# Altium schematic sheet ECG.SchDoc
size A; SheetNumber: 3; SheetTotal: 3
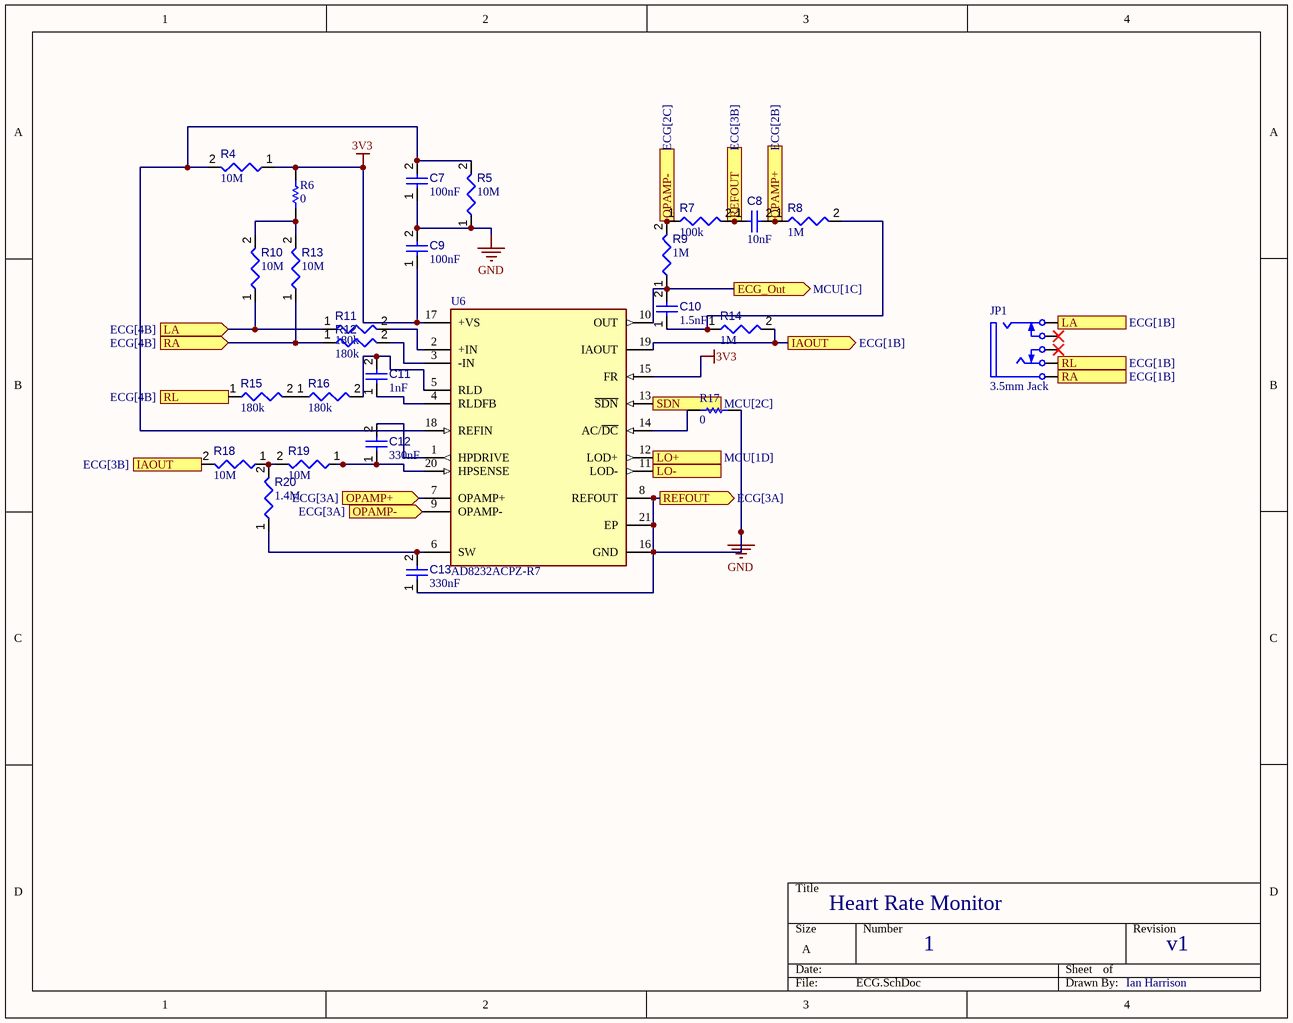
[diagram p0: ECG.SchDoc]

## Parts
C7  value 100nF  [CAPC1608X90X40NL10T20]  (hidden comment: Capacitor 100 nF +/-10% 50 V 0603)
C8  value 10nF  [FP-CC0603-DA-IPC_B]  (hidden comment: Capacitor 10nF 0603)
C9  value 100nF  [CAPC1608X90X40NL10T20]  (hidden comment: Capacitor 100 nF +/-10% 50 V 0603)
C10  value 1.5nF  [FP-GRM188-0_1-e0_2_0_5-IPC_B]  (hidden comment: Capacitor 1.5 nF 0603)
C11  value 1nF  [FP-0603-L_1_6_0_15-W_0_81-IPC_C]  (hidden comment: Capacitor 1 nF 0603)
C12  value 330nF  [FP-C1608-080-0_1-IPC_B]  (hidden comment: Capacitor .33 uF 0603)
C13  value 330nF  [FP-C1608-080-0_1-IPC_B]  (hidden comment: Capacitor .33 uF 0603)
JP1  3.5mm Jack  [SWIT-35RASMT4BHNTRX_V]
R4  value 10M  [RESC1608X55X30LL15T15]  (hidden comment: Resistor 10M)
R5  value 10M  [RESC1608X55X30LL15T15]  (hidden comment: Resistor 10M)
R6  value 0  [RESC1608X55X25ML10T15]  (hidden comment: Resistor 0R +/- 5% 0603 100 mW)
R7  value 100k  [RESC1608X55X25ML10T15]  (hidden comment: Resistor 100k +/-1% 0603 100 mW)
R8  value 1M  [FP-ERJ3EK-IPC_A]  (hidden comment: Resistor 1M 0603)
R9  value 1M  [FP-ERJ3EK-IPC_A]  (hidden comment: Resistor 1M 0603)
R10  value 10M  [RESC1608X55X30LL15T15]  (hidden comment: Resistor 10M)
R11  value 180k  [RESC1608X55X30LL15T15]  (hidden comment: Resistor 180k)
R12  value 180k  [RESC1608X55X30LL15T15]  (hidden comment: Resistor 180k)
R13  value 10M  [RESC1608X55X30LL15T15]  (hidden comment: Resistor 10M)
R14  value 1M  [FP-ERJ3EK-IPC_A]  (hidden comment: Resistor 1M 0603)
R15  value 180k  [RESC1608X55X30LL15T15]  (hidden comment: Resistor 180k)
R16  value 180k  [RESC1608X55X30LL15T15]  (hidden comment: Resistor 180k)
R17  value 0  [RESC1608X55X25ML10T15]  (hidden comment: Resistor 0R +/- 5% 0603 100 mW)
R18  value 10M  [RESC1608X55X30LL15T15]  (hidden comment: Resistor 10M)
R19  value 10M  [RESC1608X55X30LL15T15]  (hidden comment: Resistor 10M)
R20  value 1.4M  [RESC1609X50X30NL10T20]  (hidden comment: Resistor 1.4M 0603)
U6  AD8232ACPZ-R7  [FP-CP-20-8-IPC_B]

## Ports
ECG_Out (out, see MCU[1C]), IAOUT (in, see ECG[3B]), IAOUT (out, see ECG[1B]), LA (in, see ECG[4B]), LA (out, see ECG[1B]), LO+ (out, see MCU[1D]), LO- (out), OPAMP+ (in, see ECG[3A]), OPAMP+ (out, see ECG[2B]), OPAMP- (in, see ECG[3A]), OPAMP- (out, see ECG[2C]), RA (in, see ECG[4B]), RA (out, see ECG[1B]), REFOUT (in, see ECG[3B]), REFOUT (out, see ECG[3A]), RL (in, see ECG[4B]), RL (out, see ECG[1B]), SDN (in, see MCU[2C])

## Nets
3V3: C9.1 R4.1 R6.2 U6.15(FR) U6.17(+VS)
GND: C7.1 C8.1 C9.2 C13.1 R5.1 R7.2 R17.1 U6.8(REFOUT) U6.16(GND) U6.21(EP) ; port REFOUT
ECG_Out: C10.2 R9.1 U6.10(OUT) ; port ECG_Out
IAOUT: R14.2 R18.2 U6.19(IAOUT) ; port IAOUT
LA: JP1.2 R10.1 R11.1 ; port LA
LO+: U6.12(LOD+) ; port LO+
LO-: U6.11(LOD-) ; port LO-
OPAMP+: C8.2 R8.1 U6.7(OPAMP+) ; port OPAMP+
OPAMP-: R7.1 R9.2 U6.9(OPAMP-) ; port OPAMP-
RA: JP1.1 R12.1 R13.1 ; port RA
RL: JP1.3 R15.1 ; port RL
SDN: U6.13(~{SDN}) ; port SDN
NetC7_2: C7.2 R4.2 R5.2 U6.18(REFIN)
NetC10_1: C10.1 R8.2 R14.1
NetC11_1: C11.1 U6.4(RLDFB)
NetC11_2: C11.2 R16.2 U6.5(RLD)
NetC12_1: C12.1 R19.1 U6.20(HPSENSE)
NetC12_2: C12.2 U6.1(HPDRIVE)
NetC13_2: C13.2 R20.1 U6.6(SW)
NetR6_1: R6.1 R10.2 R13.2
NetR11_2: R11.2 U6.2(+IN)
NetR12_2: R12.2 U6.3(-IN)
NetR15_2: R15.2 R16.1
NetR17_2: R17.2 U6.14(AC/~{DC})
NetR18_1: R18.1 R19.2 R20.2

Not connected (* = marked no-connect by the designer): JP1 4* 5*

## Notes on the sheet
- Heart Rate Monitor
- 1
- v1
- Ian Harrison

## Library data of the parts
C7 C9 = CMP-001-00017-7: Chip Capacitor, 100 nF, +/- 10%, 50 V, 0603 (1608 Metric); Voltage Rating: 50V; Capacitor Type: Ceramic; Tolerance: 10%; Mounting Technology: SM; Max Operating Temperature: 125°C; RoHS Compliant: True; Pins: 2; Case/Package: 0603; Min Operating Temperature: -55°C
C8 = CMP-001-00089-2: Ceramic Capacitor, Multilayer, Ceramic, 50V, 10% +Tol, 10% -Tol, X7R, 15% TC, 0.01uF, Surface Mount, 0603; Pins: 2; RoHS Compliant: Yes; Capacitor Type: Ceramic; Max Operating Temperature: 125°C; Min Operating Temperature: -55°C; Case/Package: 0603; Mounting Technology: Surface Mount
C10 = CMP-001-00088-2: Ceramic Capacitor, Multilayer, Ceramic, 50V, 5% +Tol, 5% -Tol, C0G, 30ppm/Cel TC, 0.0015uF, Surface Mount, 0603; RoHS Compliant: Yes; Max Operating Temperature: 125°C; Mounting Technology: Surface Mount; Pins: 2; Min Operating Temperature: -55°C; Capacitor Type: Ceramic; Case/Package: 0603
C11 = CMP-001-00087-2: Ceramic Capacitor, Multilayer, Ceramic, 50V, 10% +Tol, 10% -Tol, X7R, 15% TC, 0.001uF, Surface Mount, 0603; Mounting Technology: Surface Mount; Pins: 2; Capacitor Type: Ceramic; Min Operating Temperature: -55°C; Max Operating Temperature: 125°C; RoHS Compliant: Yes; Case/Package: 0603
C12 C13 = CMP-001-00086-2: Ceramic Capacitor, Multilayer, Ceramic, 50V, 10% +Tol, 10% -Tol, X7R, 15% TC, 0.33uF, Surface Mount, 0603; Mounting Technology: Surface Mount; Min Operating Temperature: -55°C; Max Operating Temperature: 125°C; Capacitor Type: Ceramic; Case/Package: 0603; Pins: 2; RoHS Compliant: Yes
JP1 = CMP-002-00071-1: 3 Pole(s), Surface Mount Terminal, Jack; Connector Type: AUDIO/RCA CONNECTOR; Mounting Technology: Board; RoHS Compliant: Yes
R4 R5 R10 R13 R18 R19 = CMP-009-00182-1: Fixed Resistor, Metal Glaze/thick Film, 0.1W, 10000000ohm, 75V, 5% +/-Tol, -400,150ppm/Cel, Surface Mount, 0603; Power: 100mW; Mounting Technology: Surface Mount; Pins: 2; Max Operating Temperature: 155°C; Case/Package: 0603; RoHS Compliant: Yes; Tolerance: 5%; Min Operating Temperature: -55°C
R6 R17 = CMP-009-00006-5: Chip Resistor, 0 Ohm, 0.1 W, -55 to 155 degC, 0603 (1608 Metric); Power: 100mW; Voltage Rating: 50V; Max Operating Temperature: 155°C; RoHS Compliant: True; Mounting Technology: SM; Case/Package: 0603; Min Operating Temperature: -55°C; Tolerance: 5%; Pins: 2
R7 = CMP-009-00023-5: Chip Resistor, 100 KOhm, +/- 1%, 0.1 W, -55 to 155 degC, 0603 (1608 Metric); Voltage Rating: 50V; Power: 100mW; Max Operating Temperature: 155°C; RoHS Compliant: True; Tolerance: 1%; Pins: 2; Case/Package: 0603; Mounting Technology: SM; Min Operating Temperature: -55°C
R8 R9 R14 = CMP-009-00185-2: Fixed Resistor, Metal Glaze/thick Film, 0.1W, 1000000ohm, 75V, 1% +/-Tol, 100ppm/Cel, Surface Mount, 0603; Power: 100mW; Pins: 2; Mounting Technology: Surface Mount; Case/Package: 0603; Min Operating Temperature: -55°C; Max Operating Temperature: 155°C; Tolerance: 1%; RoHS Compliant: Yes
R11 R12 R15 R16 = CMP-009-00177-1: Fixed Resistor, Metal Glaze/thick Film, 0.1W, 180000ohm, 75V, 1% +/-Tol, 100ppm/Cel, Surface Mount, 0603; Power: 100mW; RoHS Compliant: Yes; Mounting Technology: Surface Mount; Pins: 2; Case/Package: 0603; Tolerance: 1%; Max Operating Temperature: 155°C; Min Operating Temperature: -55°C
R20 = CMP-009-00184-1: Fixed Resistor, Metal Glaze/thick Film, 0.1W, 1400000ohm, 75V, 1% +/-Tol, 100ppm/Cel, Surface Mount, 0603; Power: 100mW; RoHS Compliant: Yes; Mounting Technology: Surface Mount; Max Operating Temperature: 155°C; Pins: 2; Case/Package: 0603; Min Operating Temperature: -55°C; Tolerance: 1%
U6 = CMP-010-00024-1: Analog Circuit, 1 Func, 1 Channel; Min Supply Voltage: 2V; Max Supply Voltage: 3.5V; Nominal Supply Voltage: 3V; Case/Package: HVQCCN; Min Operating Temperature: -40°C; Max Operating Temperature: 85°C; Pins: 20; RoHS Compliant: Yes